# EAGLE schematic Teensy_Main (EAGLE 9.6.2)
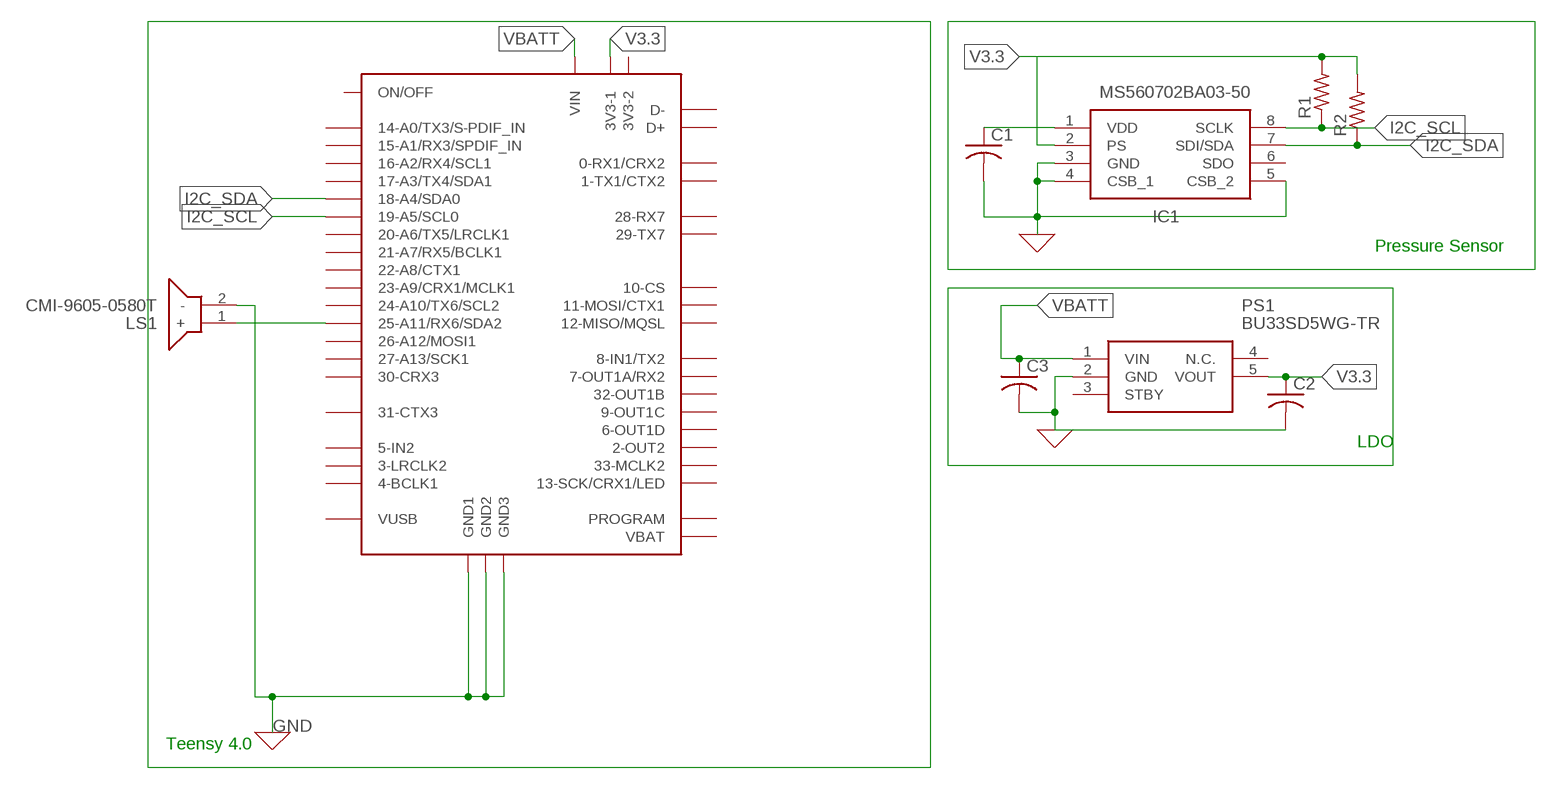
[diagram p0: schematic, sheet 1]

## Parts
C1  C-US025-024X044  [C025-024X044]
C2  C-US025-024X044  [C025-024X044]
C3  C-US025-024X044  [C025-024X044]
IC1  MS560702BA03-50  [MS5607-02BA03]
LS1  CMI-9605-0580T  [CMI96050580T]
PS1  BU33SD5WG-TR  [SOT95P280X125-5N]
R1  FLIPFLOP-RES  [0805-THM]
R2  FLIPFLOP-RES  [0805-THM]
U$1  TEENSY40  [TEENSY40]

## Nets
0: C1.2 C2.2 C3.2 IC1.3(GND) IC1.4(CSB_1) IC1.5(CSB_2) PS1.2(GND) ; supply symbol labelled GND
GND: LS1.2(-) U$1.GND1 U$1.GND2 U$1.GND3
I2C_SCL: IC1.8(SCLK) R1.1 U$1.19-A5/SCL0
I2C_SDA: IC1.7(SDI/SDA) R2.1 U$1.18-A4/SDA0
N$2: C1.1 IC1.1(VDD)
N$5: LS1.1(+) U$1.25-A11/SDA2(25-A11/RX6/SDA2)
V3.3: C2.1 IC1.2(PS) PS1.5(VOUT) R1.2 R2.2 U$1.3V3-1
VBATT: C3.1 PS1.1(VIN) U$1.VIN
Unconnected: IC1.6(SDO) PS1.3(STBY) PS1.4(N.C.) U$1.0-RX1(0-RX1/CRX2) U$1.1-TX1(1-TX1/CTX2) U$1.2-OUT2 U$1.3-LRCLK2 U$1.3V3-2 U$1.4-BCLK2(4-BCLK1) U$1.5-IN2 U$1.6-OUT1D U$1.7-RX2/OUT1A(7-OUT1A/RX2) U$1.8-TX2/IN1(8-IN1/TX2) U$1.9-OUT1C U$1.10-CS/MQSR(10-CS) U$1.11-MOSI/CTX1 U$1.12-MIO/MQSL(12-MISO/MQSL) U$1.13-SCK/CRX1/LED U$1.14-A0/TX3/S-PFI_OUT(14-A0/TX3/S-PDIF_IN) U$1.15-A1/RX3/S-PDIF_IN(15-A1/RX3/SPDIF_IN) U$1.16-A2/RX4/SCL1 U$1.17-A3/TX4/SDA1 U$1.20-A6/TX5/LRCLK1 U$1.21-A7/RX5/BCLK1 U$1.22-A8/CTX1 U$1.23-A9/CRX1/CCLK1(23-A9/CRX1/MCLK1) U$1.24-A10/TX6/SCL2 U$1.26-A12/MOSI1 U$1.27-A13/SCK1 U$1.28-RX7 U$1.29-TX7 U$1.30-CRX3 U$1.31-CTX3 U$1.32-OUTB1(32-OUT1B) U$1.33-MCLK2 U$1.D+ U$1.D- U$1.ON/OFF U$1.PROGRAM U$1.VBAT U$1.VUSB

## Notes on the sheet
- Pressure Sensor
- LDO
- Teensy 4.0

## Library data of the parts
C1-C3 = adafruit:C-US: CAPACITOR, American symbol
IC1 = MS560702BA03-50:MS560702BA03-50: MS560702BA03-50, Barometric Pressure Sensor, 1200mbar 0 3.6 V Output, 8-Pin QFN Source: Datasheet <http://www.te.com/commerce/DocumentDelivery/DDEController?Action=srchrtrv&DocNm=MS5607-02BA03&DocType=Data Sheet&DocLang=English>; DESCRIPTION: MS560702BA03-50, Barometric Pressure Sensor, 1200mbar 0 3.6 V Output, 8-Pin QFN; HEIGHT: mm; MANUFACTURER_NAME: TE Connectivity; MANUFACTURER_PART_NUMBER: MS560702BA03-50; MOUSER_PART_NUMBER: 824-MS560702BA03-50; MOUSER_PRICE-STOCK: https://www.mouser.co.uk/ProductDetail/Measurement-Specialties/MS560702BA03-50?qs=urSpXqmdEVImCZG1H%252BT8ng%3D%3D
LS1 = CMI-9605-0580T:CMI-9605-0580T: Piezo Buzzers & Audio Indicators buzzer, 9.6 mm x 5 mm deep, M, 5 VDC, 80 dB, Through Hole, Audio Indicator Source: Datasheet <https://componentsearchengine.com/Datasheets/1/CMI-9605-0580T.pdf>; DESCRIPTION: Piezo Buzzers & Audio Indicators buzzer, 9.6 mm x 5 mm deep, M, 5 VDC, 80 dB, Through Hole, Audio Indicator; HEIGHT: 5mm; MANUFACTURER_NAME: CUI Inc.; MANUFACTURER_PART_NUMBER: CMI-9605-0580T; MOUSER_PART_NUMBER: 490-CMI-9605-0580T; MOUSER_PRICE-STOCK: https://www.mouser.co.uk/ProductDetail/CUI-Devices/CMI-9605-0580T?qs=P1JMDcb91o49u9Yh70m6sw%3D%3D
PS1 = BU33SD5WG-TR:BU33SD5WG-TR: LDO regulator,3.3V,0.5A,standby,SSOP5 ROHM BU33SD5WG-TR, LDO Voltage Regulator, 0.5A, 3.3 V +/-2%, 1.7 6 Vin, 5-Pin SSOP Source: Datasheet <https://componentsearchengine.com/Datasheets/1/BU33SD5WG-TR.pdf>; DESCRIPTION: LDO regulator,3.3V,0.5A,standby,SSOP5 ROHM BU33SD5WG-TR, LDO Voltage Regulator, 0.5A, 3.3 V +/-2%, 1.7 6 Vin, 5-Pin SSOP; HEIGHT: 1.25mm; MANUFACTURER_NAME: ROHM Semiconductor; MANUFACTURER_PART_NUMBER: BU33SD5WG-TR; MOUSER_PART_NUMBER: 755-BU33SD5WG-TR; MOUSER_PRICE-STOCK: https://www.mouser.co.uk/ProductDetail/ROHM-Semiconductor/BU33SD5WG-TR?qs=%2FKR40Cd6GUrQDzRkUEt69Q%3D%3D
R1 R2 = adafruit:FLIPFLOP-RES: Flip Flop resistor An 0805 resistor inside a standard 1/4W 5% resistor. Makes for easy mods
U$1 = teensy:TEENSY40: Teensy 4.0 device including POGO pins for pins 24 - 33, but not yet pins for D+ and D-. Symbol layout is what works for me and may not suite everyone... that can be added or additional symbols can be created to be used in a modilied davie name.